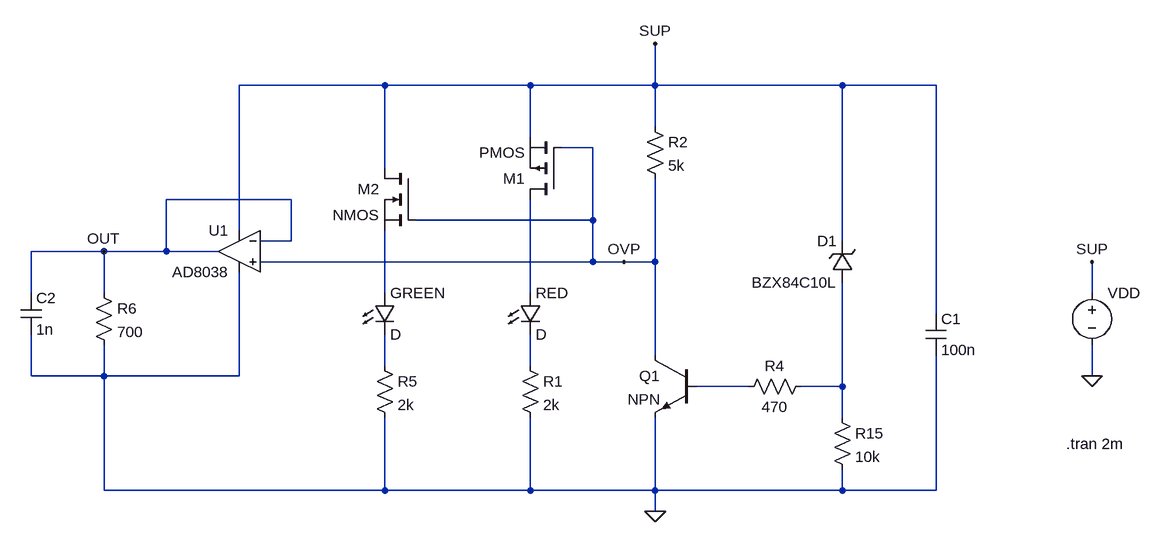
[diagram p0: schematic Overvoltage_Protection_v1.asc]
Overvoltage_Protection_v1.asc, the LTspice schematic file:
Version 4
SHEET 1 972 680
WIRE -512 -512 -736 -512
WIRE -288 -512 -512 -512
WIRE -96 -512 -96 -576
WIRE -96 -512 -288 -512
WIRE 192 -512 -96 -512
WIRE 336 -512 192 -512
WIRE -96 -448 -96 -512
WIRE -288 -432 -288 -512
WIRE -192 -416 -240 -416
WIRE -512 -384 -512 -512
WIRE -656 -336 -848 -336
WIRE -192 -304 -192 -416
WIRE -192 -304 -464 -304
WIRE -736 -288 -736 -512
WIRE -656 -272 -656 -336
WIRE -656 -272 -704 -272
WIRE 192 -272 192 -512
WIRE -944 -256 -1056 -256
WIRE -848 -256 -848 -336
WIRE -848 -256 -944 -256
WIRE -768 -256 -848 -256
WIRE -192 -240 -192 -304
WIRE -192 -240 -704 -240
WIRE -144 -240 -192 -240
WIRE -96 -240 -96 -368
WIRE -96 -240 -144 -240
WIRE -1056 -192 -1056 -256
WIRE -944 -192 -944 -256
WIRE -512 -192 -512 -288
WIRE -288 -192 -288 -336
WIRE 576 -192 576 -240
WIRE 336 -160 336 -512
WIRE -96 -96 -96 -240
WIRE -512 -80 -512 -128
WIRE -288 -80 -288 -128
WIRE -1056 -64 -1056 -128
WIRE -944 -64 -944 -112
WIRE -944 -64 -1056 -64
WIRE -736 -64 -736 -224
WIRE -736 -64 -944 -64
WIRE 576 -64 576 -112
WIRE 48 -48 -32 -48
WIRE 192 -48 192 -208
WIRE 192 -48 128 -48
WIRE 192 0 192 -48
WIRE -944 112 -944 -64
WIRE -512 112 -512 0
WIRE -512 112 -944 112
WIRE -288 112 -288 0
WIRE -288 112 -512 112
WIRE -96 112 -96 0
WIRE -96 112 -288 112
WIRE 192 112 192 80
WIRE 192 112 -96 112
WIRE 336 112 336 -96
WIRE 336 112 192 112
WIRE -96 144 -96 112
FLAG 576 -64 0
FLAG 576 -240 SUP
FLAG -96 -576 SUP
FLAG -96 144 0
FLAG -944 -256 OUT
FLAG -144 -240 OVP
SYMBOL zener 208 -208 R180
WINDOW 0 24 64 Left 2
WINDOW 3 24 0 Left 2
SYMATTR InstName D1
SYMATTR Value BZX84C10L
SYMBOL res 176 -16 R0
SYMATTR InstName R15
SYMATTR Value 10k
SYMBOL res 144 -64 R90
WINDOW 0 0 56 VBottom 2
WINDOW 3 32 56 VTop 2
SYMATTR InstName R4
SYMATTR Value 470
SYMBOL voltage 576 -208 R0
WINDOW 3 24 96 Invisible 2
WINDOW 123 0 0 Left 0
WINDOW 39 0 0 Left 0
SYMATTR Value PULSE(9 11 0.5m 0.2m 0.2m 0.6m 2m 1)
SYMATTR InstName VDD
SYMBOL res -112 -464 R0
SYMATTR InstName R2
SYMATTR Value 5k
SYMBOL npn -32 -96 M0
SYMATTR InstName Q1
SYMBOL LED -304 -192 R0
SYMATTR InstName RED
SYMBOL res -304 -96 R0
SYMATTR InstName R1
SYMATTR Value 2k
SYMBOL pmos -240 -336 R180
SYMATTR InstName M1
SYMBOL nmos -464 -384 M0
SYMATTR InstName M2
SYMBOL res -528 -96 R0
SYMATTR InstName R5
SYMATTR Value 2k
SYMBOL LED -528 -192 R0
SYMATTR InstName GREEN
SYMBOL cap 320 -160 R0
SYMATTR InstName C1
SYMATTR Value 100n
SYMBOL Opamps\\AD8038 -736 -320 M0
SYMATTR InstName U1
SYMBOL res -960 -208 R0
SYMATTR InstName R6
SYMATTR Value 700
SYMBOL cap -1072 -192 R0
SYMATTR InstName C2
SYMATTR Value 1n
TEXT 536 40 Left 2 !.tran 2m

The netlist it stands for:
* Overvoltage_Protection_v1.asc
D1 N006 SUP BZX84C10L
R15 N006 0 10k
R4 N006 N005 470
VDD SUP 0 PULSE(9 11 0.5m 0.2m 0.2m 0.6m 2m 1)
R2 SUP OVP 5k
Q1 OVP N005 0 0 NPN
D§RED N002 N004 D
R1 N004 0 2k
M1 N002 OVP SUP SUP PMOS
M2 SUP OVP N001 N001 NMOS
R5 N003 0 2k
D§GREEN N001 N003 D
C1 SUP 0 100n
XU1 OVP OUT SUP 0 OUT AD8038  ; pins In+ In- V+ V- OUT
R6 OUT 0 700
C2 OUT 0 1n
.model D D
.lib standard.dio
.model NPN NPN
.model PNP PNP
.lib standard.bjt
.model NMOS NMOS
.model PMOS PMOS
.lib standard.mos
.tran 2m
.backanno
.end